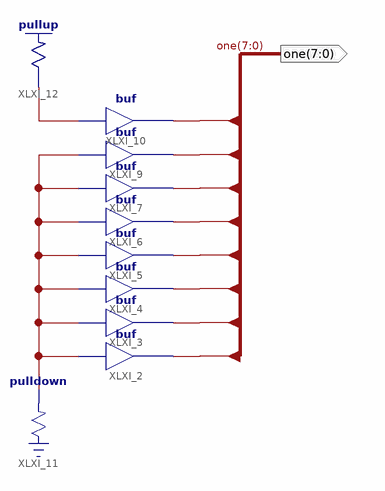
[diagram p0: schematic sheet 1]
// Xilinx ISE schematic one_8bit.sch (aspartan6) as structural Verilog: 10 symbols, 1 ports
module one_8bit (
  output [7:0] one
);

  wire XLXN_10, XLXN_11;

  buf XLXI_2 (one[7], XLXN_10);
  buf XLXI_3 (one[6], XLXN_10);
  buf XLXI_4 (one[5], XLXN_10);
  buf XLXI_5 (one[4], XLXN_10);
  buf XLXI_6 (one[3], XLXN_10);
  buf XLXI_7 (one[2], XLXN_10);
  buf XLXI_9 (one[1], XLXN_10);
  buf XLXI_10 (one[0], XLXN_11);
  \pulldown  XLXI_11 (.O(XLXN_10));
  \pullup  XLXI_12 (.O(XLXN_11));
endmodule
